# EAGLE design ASM4003 (EAGLE 6.3)
DATABASE: ./../../../../../Components/TinyCircuits_Part_Database.txt
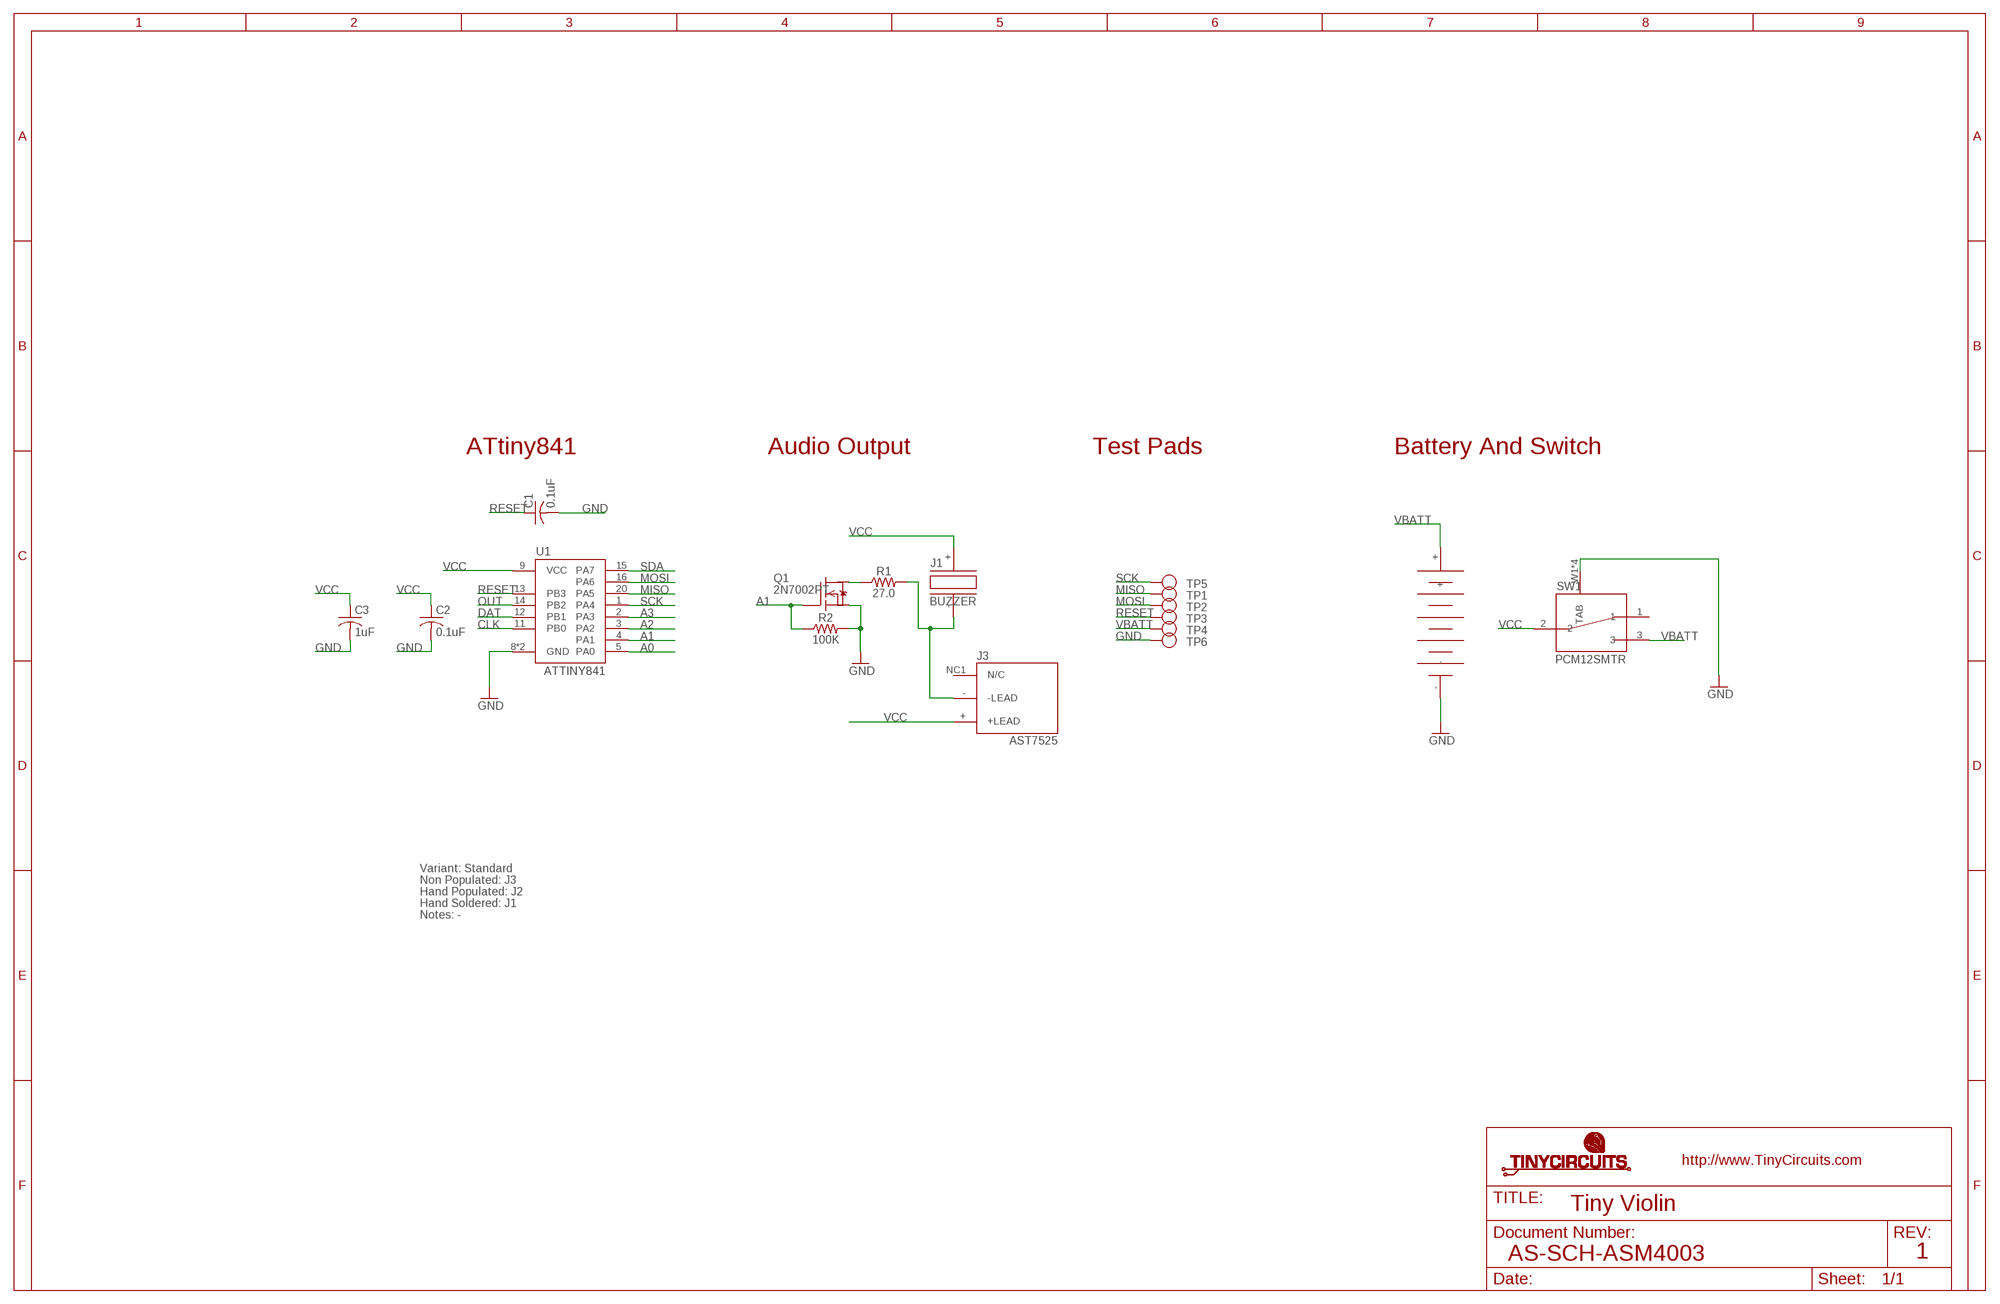
[diagram p0: schematic, sheet 1]

## Parts
C1  0.1uF  AS-ITM-00008  [C0402]
C2  0.1uF  AS-ITM-00008  [C0402]
C3  1uF  AS-ITM-00105  [C0402]
J1  BUZZER  AS-ITM-00440  [BUZZER_12MM]
J2  1225  AS-ITM-00468  [COIN_1220_SMD]
J3  AST7525  AS-ITM-00390  [AST7525]
Q1  2N7002PT  AS-ITM-00110  [SOT-416]
R1  27.0  AS-ITM-00240  [0402]
R2  100K  AS-ITM-00004  [0402]
SW1  PCM12SMTR  AS-ITM-00469  [PCM12SMTR]
TP1  TEST_POINT  [TEST_POINT_1MM]
TP2  TEST_POINT  [TEST_POINT_1MM]
TP3  TEST_POINT  [TEST_POINT_1MM]
TP4  TEST_POINT  [TEST_POINT_1MM]
TP5  TEST_POINT  [TEST_POINT_1MM]
TP6  TEST_POINT  [TEST_POINT_1MM]
U1  ATTINY841  AS-ITM-00255  [VQFN-20]

## Nets
A0: U1.5(PA0)
A1: Q1.1(G) R2.1 U1.4(PA1)
A2: U1.3(PA2)
A3: U1.2(PA3)
CLK: U1.11(PB0)
DAT: U1.12(PB1)
GND: C1.2 C2.2 C3.2 J2.- Q1.2(S) R2.2 SW1.W1(TAB) SW1.W2(TAB) SW1.W3(TAB) SW1.W4(TAB) TP6.P$1 U1.8(GND) U1.PAD(GND)
MISO: TP1.P$1 U1.20(PA5)
MOSI: TP2.P$1 U1.16(PA6)
N$1: Q1.3(D) R1.1
N$2: J1.- J3.-(-LEAD) R1.2
OUT: U1.14(PB2)
RESET: C1.1 TP3.P$1 U1.13(PB3)
SCK: TP5.P$1 U1.1(PA4)
SDA: U1.15(PA7)
VBATT: J2.+ SW1.3 TP4.P$1
VCC: C2.1 C3.1 J1.+ J3.+(+LEAD) SW1.2 U1.9(VCC)
Unconnected: J3.NC1(N/C) SW1.1

## Notes on the sheet
- ATtiny841 | Audio Output | Test Pads | Battery And Switch
- Variant: Standard
- Non Populated: J3
- Hand Populated: J2
- Hand Soldered: J1
- Notes: -
- Tiny Violin
- AS-SCH-ASM4003 | 1

## Library data of the parts
C1 C2 = tinycircuits:AS-ITM-00008: CAP CER 0.1UF 16V 10% X5R 0402; PARTNO: AS-ITM-00008
C3 = tinycircuits:AS-ITM-00105: CAP CER 1UF 6.3V 10% X5R 0402; PARTNO: AS-ITM-00105
J1 = tinycircuits:AS-ITM-00440: 12MM BUZZER TH; PARTNO: AS-ITM-00440
J2 = tinycircuits:AS-ITM-00468: HOLDER COIN CELL 1225; PARTNO: AS-ITM-00468
J3 = tinycircuits:AS-ITM-00390: AUDIO MAGNETIC XDCR 2.5-4.5V SMD; PARTNO: AS-ITM-00390
Q1 = tinycircuits:AS-ITM-00110: MOSFET N-CH SGL 60V SOT-416; PARTNO: AS-ITM-00110
R1 = tinycircuits:AS-ITM-00240: RES 27 OHM 1/16W 5% 0402 SMD; PARTNO: AS-ITM-00240
R2 = tinycircuits:AS-ITM-00004: RES 100K OHM 1/16W 1% 0402; PARTNO: AS-ITM-00004
SW1 = tinycircuits:AS-ITM-00469: SW SLIDE SP2T 6VDC 0.3A SMT; PARTNO: AS-ITM-00469; PNPROTATION: 0
TP1-TP6 = tinycircuits:TEST_POINT: Test point, no drill
U1 = tinycircuits:AS-ITM-00255: IC MCU 8BIT 8KB FLASH 20VQFN; PARTNO: AS-ITM-00255

## Board
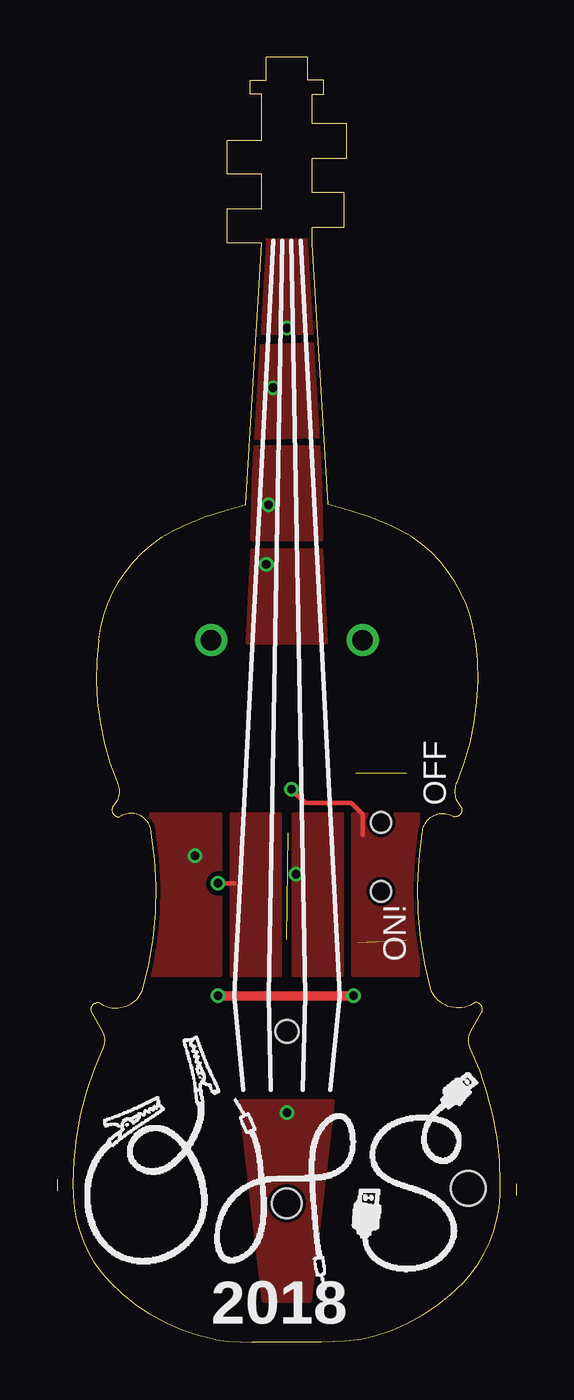
[diagram p1: board, top side]
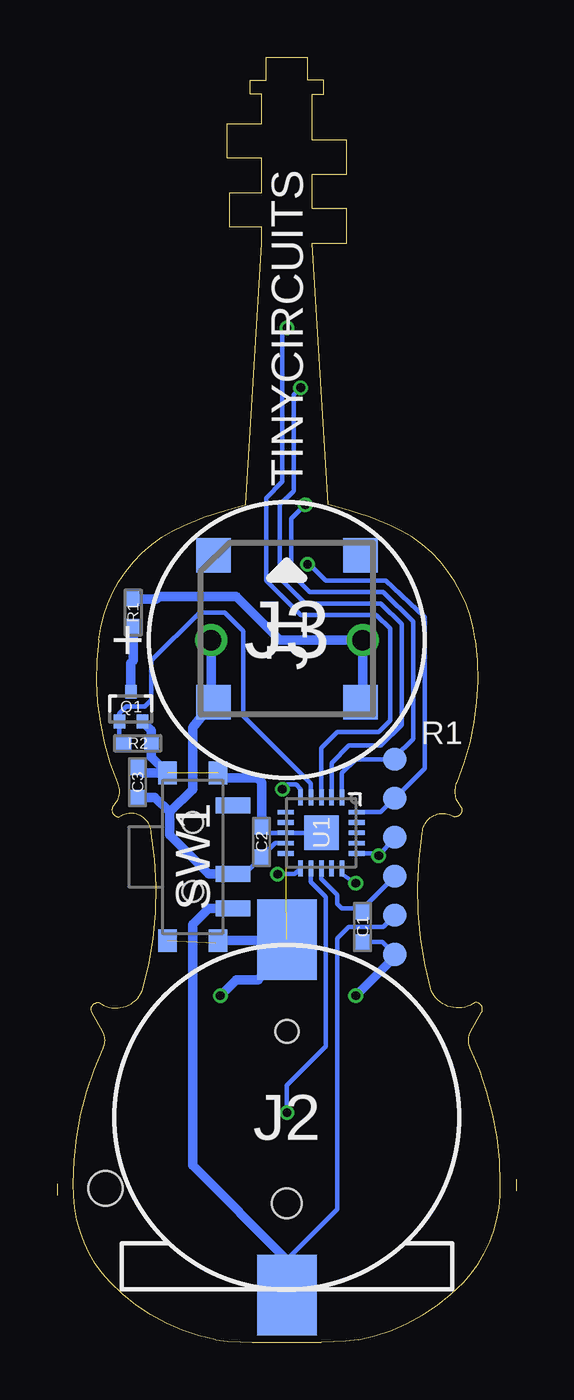
[diagram p2: board, bottom side, seen from below]

Size 20 x 56 mm. Coordinates in mm from the lower left corner, seen from the top.
Outline: 0,7.1 0,6.6
Outline: 20,6.9 20,6.4
Outline: 6.9,0.1 arc-35 2.3,2.6 arc-45 0.7,6.9 arc-25 2,12.8 arc50 2,13.5 1.5,14.4 arc-120 1.8,14.8 arc100 3.7,15.3 arc25 4.1,22.2 arc120 2.7,22.9 arc-120 2.4,23.3 2.6,23.6 arc50 2.6,24.4 arc-30 1.8,30.6 arc-60 5.5,35.6 arc-10 8.2,36.5 8.9,47.9 7.4,47.9 7.4,49.4 8.9,49.4 8.9,50.9 7.4,50.9 7.4,52.4 8.9,52.4 8.9,54.4 8.4,54.4 8.4,55 9.1,55 9.1,56 10.9,56 10.9,55 11.6,55 11.6,54.4 11.1,54.4 11.1,53.1 12.6,53.1 12.6,51.6 11.1,51.6 11.1,50.1 12.5,50.1 12.5,48.6 11.1,48.6 11.1,47.9 11.8,36.5 arc-10 14.5,35.6 arc-60 18.2,30.6 arc-30 17.4,24.4 arc50 17.4,23.6 17.6,23.3 arc-120 17.3,22.9 arc120 15.9,22.2 arc25 16.3,15.3 arc100 18.2,14.8 arc-120 18.5,14.4 18,13.5 arc50 18,12.8 arc-25 19.3,6.9 arc-45 17.7,2.6 arc-35 13.1,0.1 arc-8 11.5,0 8.5,0 arc-8 6.9,0.1
Copper layers (1*16): Top 0.035mm / dielectric 1.5mm / Bottom 0.035mm
Design rules "default *": minimum track width 7mil, minimum drill 15mil, track to track 8mil, track to pad 8mil, pad to pad 8mil, via to via 8mil, smd to smd 8mil, copper to edge 7mil, drill to drill 8mil, minimum pad ring 8mil, minimum via ring 5mil, stop-mask expansion 4mil, vias tented up to drill 25mil, thermal gap 10mil
Holes 1.5 mm at 17.9,6.7
bRestrict: 4 lines

### Footprints (pad centres in the part's own frame; a part is rotated, then mirrored left to right if it is on the bottom)
C0402 = smd 0.65 x 0.6: 1 -0.65,0; 2 0.65,0
BUZZER_12MM = drill 0.889 pad 1.397: + 0,3.3; - 0,-3.3
COIN_1220_SMD = smd 2.6 x 3.5: + 0,-7.75; - 0,7.75 | hole 1: 0,3.75 | hole 1.3: 0,-3.75
AST7525 = smd 1.5 x 1.5: + 3.2,3.2; - -3.2,3.2; NC1 -3.2,-3.2; NC2 3.2,-3.2
SOT-416 = smd 0.5 x 0.6: 1 -0.5,-0.65; 2 0.5,-0.65; 3 0,0.65
0402 = smd 0.65 x 0.55: 1 -0.6,0; 2 0.6,0
PCM12SMTR = smd 0.7 x 1.5: 1 -2.25,1.75; 2 0.75,1.75; 3 2.25,1.75 | smd 1 x 0.8: W1 -3.65,1.1; W2 -3.65,-1.1; W3 3.65,-1.1; W4 3.65,1.1 | hole 0.9: 1.5,0; -1.5,0
TEST_POINT_1MM = smd 1 x 1: P$1 0,0
VQFN-20 = smd 0.7 x 0.2: 1 -1.55,0.9; 2 -1.55,0.45; 3 -1.55,0; 4 -1.55,-0.45; 5 -1.55,-0.9; 11 1.55,-0.9; 12 1.55,-0.45; 13 1.55,0; 14 1.55,0.45; 15 1.55,0.9 | smd 0.2 x 0.7: 6 -0.9,-1.55; 7 -0.45,-1.55; 8 0,-1.55; 9 0.45,-1.55; 10 0.9,-1.55; 16 0.9,1.55; 17 0.45,1.55; 18 0,1.55; 19 -0.45,1.55; 20 -0.9,1.55 | smd 1.5 x 1.5: PAD 0,0

### Placement (x,y rotation side)
C1  6.7,18.1 270 bottom
C2  11.1,21.8 90 bottom
C3  16.5,24.4 90 bottom
J1  10,30.6 90 bottom
J2  10,9.8 0 bottom
J3  10,31.1 180 bottom
Q1  16.8,27.7 0 bottom
R1  16.7,31.8 90 bottom
R2  16.5,26.1 0 bottom
SW1  14.1,21.15 270 bottom
TP1  5.3,23.7 0 bottom
TP2  5.3,22 0 bottom
TP3  5.3,20.3 0 bottom
TP4  5.3,18.6 0 bottom
TP5  5.3,25.4 0 bottom
TP6  5.3,16.9 0 bottom
U1  8.5,22.2 270 bottom
U$1  [DOCFIELD-TINYCIRCUITS-PCB]  28,-10 0 top  (outside the outline)

### Tracks (layer width: path | path; a pad name or v marks a point on that pad's centre or on a via)
A0  (via drill 0.38)
  Top 0.203: v10.2,24.1 10.8,23.5 12.8,23.5 13.3,23 13.3,22.1
  Bottom 0.203: U1.5 9.4,24.1 9.6,24.3 10,24.3 v10.2,24.1
  pour Top: 12.9,16 12.9,23 15.7,23 15.7,16
A1
  Bottom 0.203: R2.1 17.3,26.3 Q1.1 17.3,27.4 17,27.7 16.2,27.7 15.9,28 15.9,29.7 13.8,31.8 12.7,31.8 11.9,31 11.9,27.3 8.95,24.35 U1.4
A2  (via drill 0.38)
  Top 0.203: v10,44.2 10.1,44.3
  Bottom 0.203: v10,44.2 10.2,44.1 10.2,37.5 10.9,36.8 10.9,33.2 9.4,31.7 6.1,31.7 5.5,31.1 5.5,27.1 6,26.6 7.8,26.6 8.5,25.9 U1.3
  pour Top: 11.2,44 8.8,44 9,48 11,48
A3  (via drill 0.38)
  Bottom 0.203: v9.4,41.6 9.7,41.3 9.7,37.1 10.3,36.5 10.3,33.3 9.2,32.2 5.9,32.2 5,31.3 5,26.9 5.9,26 7.3,26 8.05,25.25 U1.2
  pour Top: 11.4,39.5 8.6,39.4 8.8,43.4 11.2,43.5
CLK  (via drill 0.38)
  Bottom 0.203: v10.4,20.4 9.65,20.4 U1.11
  pour Top: 10.3,16 10.3,23 12.4,23 12.4,16
DAT  (via drill 0.38)
  Bottom 0.203: U1.12 8.95,20.05 8.3,19.4 8.3,12.9 10,11.2 v10,10
  pour Top: 9,1.8 8,10.5 12,10.5 11,1.8
GND  (via drill 0.38)  (3 unrouted)
  Top 0.406: v7,15.1 v12.9,15.1
  Bottom 0.203: U1.PAD U1.8 10.85,22.2 C2.2 | C1.2 5.85,17.45 TP6.P$1
  Bottom 0.406: J2.- 10.25,17.5 SW1.W4 13.1,17.4 | SW1.W1 12.8,24.6 11.3,24.6 11.1,24.4 C2.2 | Q1.2 15.9,26.65 R2.2 15.9,25.5 SW1.W2 16.25,24.8 C3.2 | 9.15,16.9 J2.- | TP6.P$1 5.3,16.8 v7,15.1 | v12.9,15.1 12.2,15.8 11.25,15.8 J2.-
MISO  (via drill 0.38)
  Bottom 0.203: U1.20 5.9,23.1 TP1.P$1 4,25 4,31.6 5.7,33.2 8.3,33.2 9,33.9 v9.1,33.9
  pour Top: 11.7,30.5 8.3,30.5 8.5,34.5 11.5,34.5
MOSI  (via drill 0.38)
  Bottom 0.203: U1.16 5.9,21.3 | TP2.P$1 5.9,21.3 | 5.9,21.3 v6,21.2
  pour Top: 4.1,16 4.1,23 7.1,23 7.1,16
N$1
  Bottom 0.406: Q1.3 16.8,29.6 16.7,29.7 R1.1
N$2
  Bottom 0.406: J3.- 6.7,27.8 J1.- 10.3,30.6 12.2,32.5 15.6,32.5 15.7,32.4 R1.2
RESET
  Bottom 0.203: U1.13 8.5,20.2 7.8,19.5 7.8,19.1 7.6,18.9 6.85,18.9 C1.1 6.65,18.8 6.65,18.95 TP3.P$1
SCK  (via drill 0.38)
  Bottom 0.203: U1.1 7.6,24.8 7,25.4 TP5.P$1 5.3,25.5 4.5,26.3 4.5,31.4 5.8,32.7 9,32.7 9.8,33.5 9.8,35.9 v9.2,36.5
  pour Top: 11.5,35 8.5,35 8.6,39 11.4,39
SDA  (via drill 0.38)
  Top 0.203: 7.7,20 v7,20
  Bottom 0.203: U1.15 7.6,20.4 v7,20
  pour Top: 7.6,16 7.6,23 9.7,23 9.7,16
VBATT
  Bottom 0.203: TP4.P$1 5.8,18.1 7.3,18.1 7.8,17.6 7.8,5.8 10,3.6
  Bottom 0.406: J2.+ 10,3.6 14.1,7.7 14.1,18.2 13.4,18.9 SW1.3
VCC
  Bottom 0.203: U1.9 10.5,21.75 C2.1 11.75,20.5 | SW1.2 11.75,20.5 | 11.7,20.45 11.75,20.5
  Bottom 0.406: 15.1,23.1 14.1,24.1 14.1,26.8 J3.+ 13.3,27.8 J1.+ | 15.1,23.1 15.1,22.1 13.4,20.4 SW1.2 | C3.1 15.75,23.75 15.1,23.1

### Text on the board
tPlace: OFF | ON! | 2018
bPlace: TINYCIRCUITS | R1
Document: FABRICATION DRAWING | NOTES: | 1. PRINTED CIRCUIT BOARD MADE FROM NEMA GRADE FR-4 EPOXY LAMINATE | WITH 1 OUNCE COPPER PLATING AND .024 THICKNESS. | 2. ALL DIMENSIONS ARE GIVEN IN INCHES. | 3. CIRCUIT PATHS ARE FOR REFERENCE ONLY. | 4. HOLE SIZES SHOWN ARE FINISHED DIAMETERS AFTER PLATING. | 5. BOARD PLATED USING REFLOW OR SIMILAR METHOD. | 6. BOARD TO HAVE BLUE SOLDER MASK ON PLATED SURFACES USING WET FILM | 7. SILKSCREEN BOARD USING WHITE INK. | SR100 OR SR1010 EPOXY. EQUIVALENT WET OR DRY FILM MAY BE USED. | 8. THE FOLLOWING INFORMATION APPLIES TO THIS BOARD: | * 2 COPPER LAYERS | * .024 BOARD THICKNESS | * REQUIRES TOP SIDE SILKSCREEN | Tiny Violin | AS-PCB-ASM4003 | 1